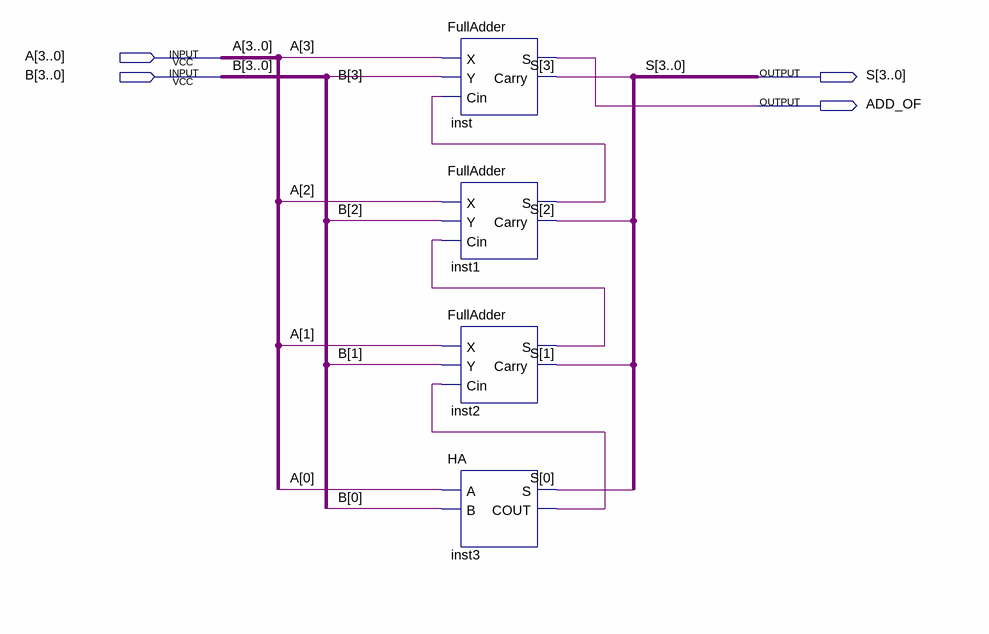
[diagram p0: schematic sheet]
// Quartus schematic CONG4BIT.bdf as structural Verilog: 4 symbols, 4 pins
module CONG4BIT (
  input  [3:0] A,
  input  [3:0] B,
  output [3:0] S,
  output ADD_OF
);

  wire inst1_s, inst2_s, inst3_cout;

  FullAdder inst (.X(A[3]), .Y(B[3]), .Cin(inst1_s), .S(ADD_OF), .Carry(S[3]));
  FullAdder inst1 (.X(A[2]), .Y(B[2]), .Cin(inst2_s), .S(inst1_s), .Carry(S[2]));
  FullAdder inst2 (.X(A[1]), .Y(B[1]), .Cin(inst3_cout), .S(inst2_s), .Carry(S[1]));
  HA inst3 (.A(A[0]), .B(B[0]), .S(S[0]), .COUT(inst3_cout));
endmodule
